# EAGLE design LED_Thermo (EAGLE 7.7.0)
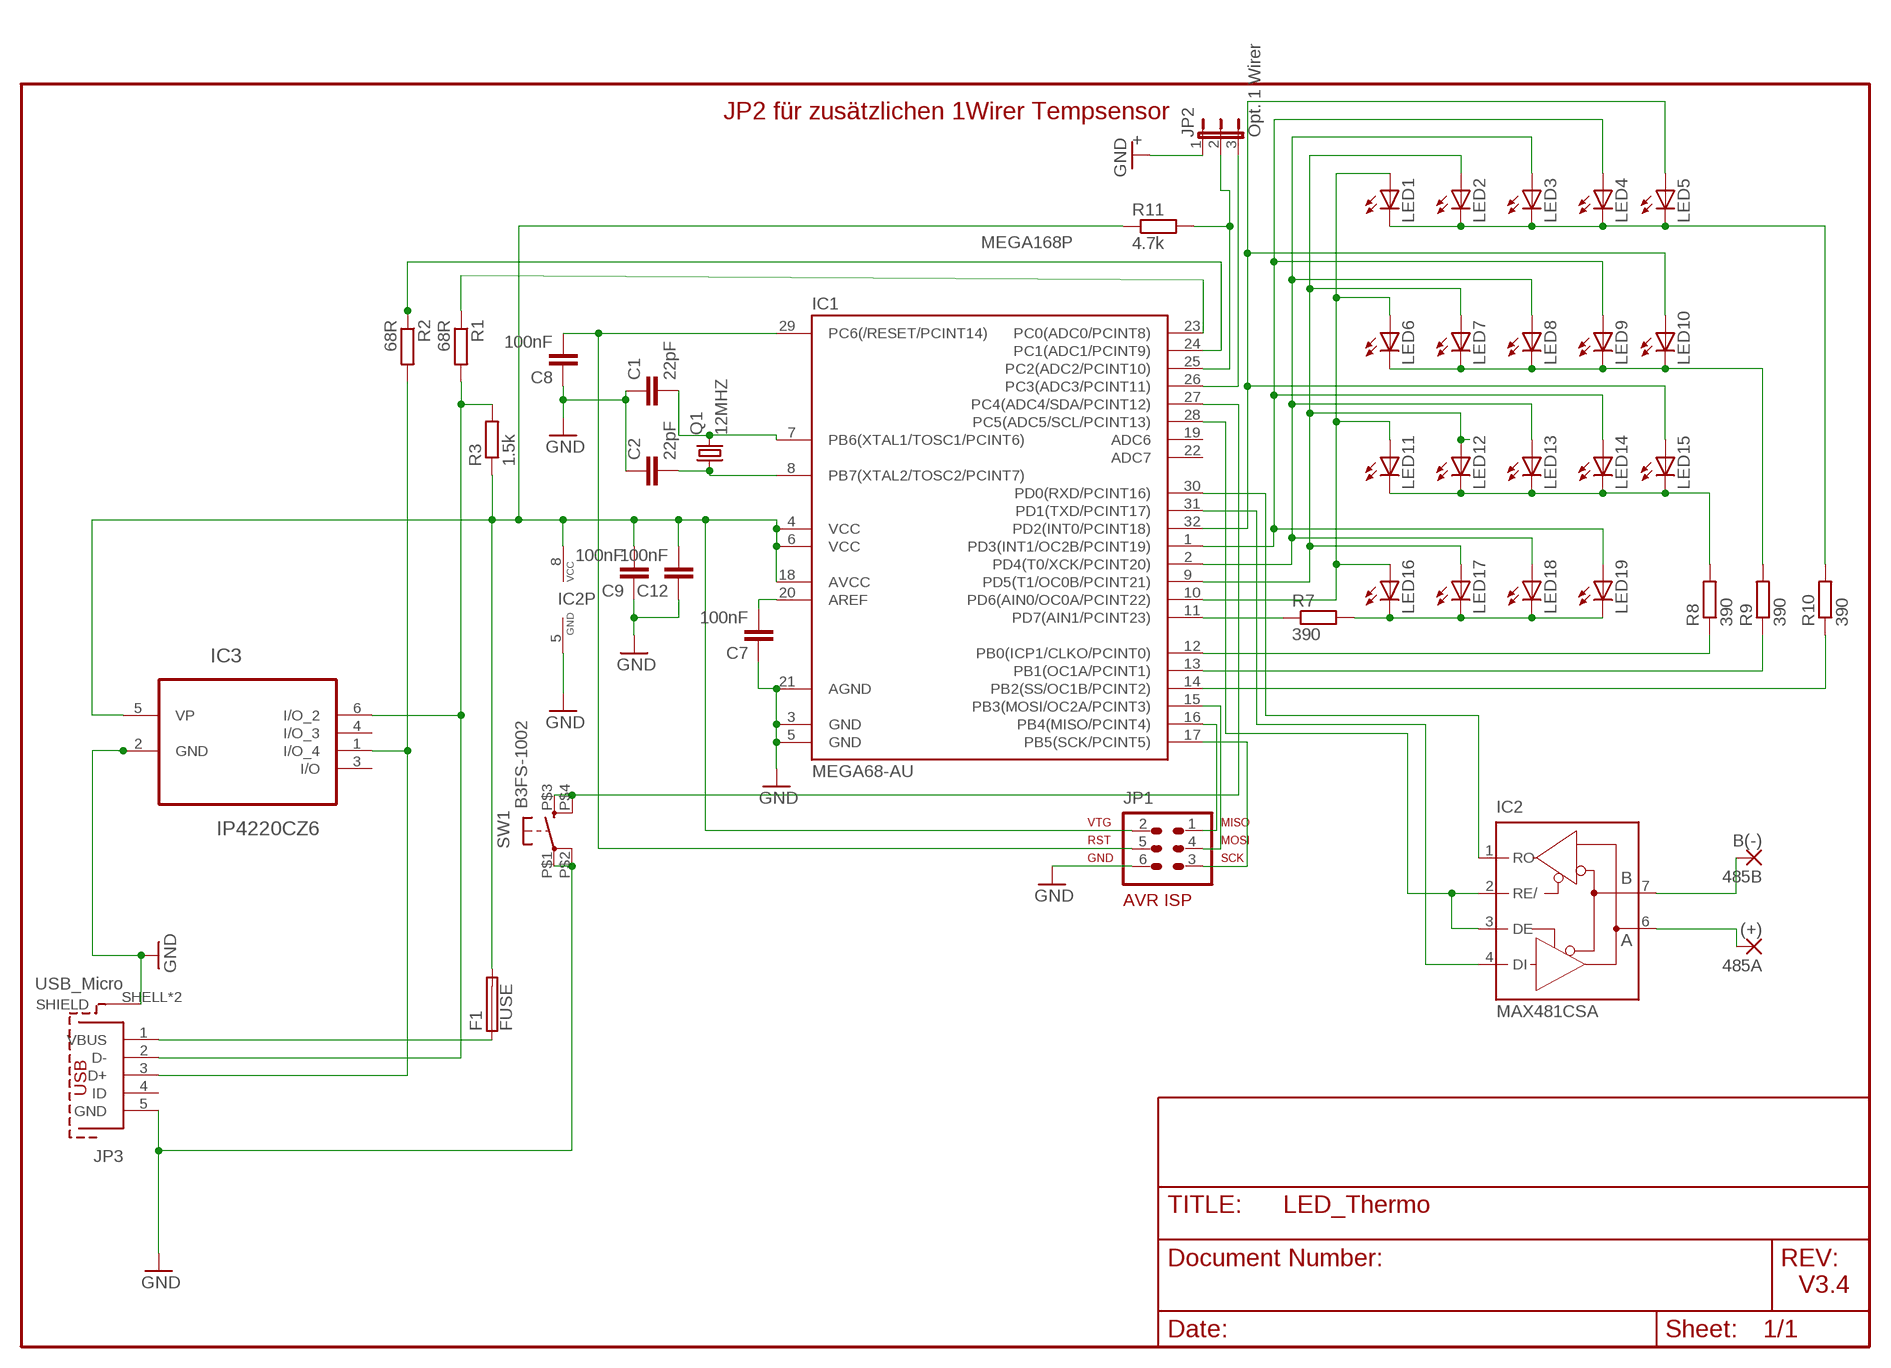
[diagram p0: schematic, sheet 1]

## Parts
485A  (+)  2,54/1,0  [2,54/1,0]
485B  B(-)  2,54/1,0  [2,54/1,0]
C1  22pF  C-EUC0805  [C0805]
C2  22pF  C-EUC0805  [C0805]
C7  100nF  C-EUC0805  [C0805]
C8  100nF  C-EUC0805  [C0805]
C9  100nF  C-EUC0805  [C0805]
C12  100nF  C-EUC0805  [C0805]
F1  FUSE  [FUSE_1206]
IC1  MEGA68-AU  MEGA48/88/168-AU  [TQFP32-08]
IC2  MAX481CSA  [SO08]
IC3  IP4220CZ6  [SOT95P275X110-6N]
JP1  AVR-ISP-6  [AVR-ISP-6]
JP2  Opt. 1 Wirer  JP2E  [JP2]
JP3  USB_Micro  614105150721  [614105150721]
LED1  LED3MM  [LED3MM]
LED2  LED3MM  [LED3MM]
LED3  LED3MM  [LED3MM]
LED4  LED3MM  [LED3MM]
LED5  LED3MM  [LED3MM]
LED6  LED3MM  [LED3MM]
LED7  LED3MM  [LED3MM]
LED8  LED3MM  [LED3MM]
LED9  LED3MM  [LED3MM]
LED10  LED3MM  [LED3MM]
LED11  LED3MM  [LED3MM]
LED12  LED3MM  [LED3MM]
LED13  LED3MM  [LED3MM]
LED14  LED3MM  [LED3MM]
LED15  LED3MM  [LED3MM]
LED16  LED3MM  [LED3MM]
LED17  LED3MM  [LED3MM]
LED18  LED3MM  [LED3MM]
LED19  LED3MM  [LED3MM]
Q1  12MHZ  CRYSTALHC18U-V  [HC18U-V]
R1  68R  R-EU_M0805  [M0805]
R2  68R  R-EU_M0805  [M0805]
R3  1.5k  R-EU_M0805  [M0805]
R7  390  R-EU_M0805  [M0805]
R8  390  R-EU_M0805  [M0805]
R9  390  R-EU_M0805  [M0805]
R10  390  R-EU_M0805  [M0805]
R11  4.7k  R-EU_M0805  [M0805]
SW1  B3FS-1002  B3FS-10XX  [B3FS-1002]

## Nets
GND: C1.1 C2.1 C7.1 C8.1 C9.1 C12.1 IC1.3(GND) IC1.5(GND) IC1.21(AGND) IC2.5(GND) IC3.2(GND) JP1.6 JP2.1 JP3.5(GND) JP3.SHELL1(SHIELD) JP3.SHELL(SHIELD) SW1.P$1(P) SW1.P$2(P1)
N$1: IC1.23(PC0(ADC0/PCINT8)) R1.1
N$2: IC1.10(PD6(AIN0/OC0A/PCINT22)) LED1.A LED6.A LED11.A LED16.A
N$3: IC1.24(PC1(ADC1/PCINT9)) R2.1
N$4: F1.1 JP3.1(VBUS)
N$5: IC1.9(PD5(T1/OC0B/PCINT21)) LED2.A LED7.A LED12.A LED17.A
N$6: IC1.27(PC4(ADC4/SDA/PCINT12)) SW1.P$3(S) SW1.P$4(S1)
N$7: IC3.1(I/O_4) JP3.3(D+) R2.2
N$8: IC3.6(I/O_2) JP3.2(D-) R1.2 R3.2
N$9: IC1.2(PD4(T0/XCK/PCINT20)) LED3.A LED8.A LED13.A LED18.A
N$10: LED16.K(C) LED17.K(C) LED18.K(C) LED19.K(C) R7.2
N$11: LED11.K(C) LED12.K(C) LED13.K(C) LED14.K(C) LED15.K(C) R8.2
N$12: IC1.1(PD3(INT1/OC2B/PCINT19)) LED4.A LED9.A LED14.A LED19.A
N$13: LED6.K(C) LED7.K(C) LED8.K(C) LED9.K(C) LED10.K(C) R9.2
N$14: LED1.K(C) LED2.K(C) LED3.K(C) LED4.K(C) LED5.K(C) R10.2
N$15: IC1.17(PB5(SCK/PCINT5)) JP1.3
N$16: IC1.16(PB4(MISO/PCINT4)) JP1.1
N$17: IC1.15(PB3(MOSI/OC2A/PCINT3)) JP1.4
N$18: IC1.12(PB0(ICP1/CLKO/PCINT0)) R8.1
N$19: IC1.13(PB1(OC1A/PCINT1)) R9.1
N$20: C7.2 IC1.20(AREF)
N$21: C8.2 IC1.29(PC6(/RESET/PCINT14)) JP1.5
N$22: IC1.14(PB2(SS/OC1B/PCINT2)) R10.1
N$23: IC1.32(PD2(INT0/PCINT18)) LED5.A LED10.A LED15.A
N$24: C1.2 IC1.7(PB6(XTAL1/TOSC1/PCINT6)) Q1.2
N$25: C2.2 IC1.8(PB7(XTAL2/TOSC2/PCINT7)) Q1.1
N$26: 485B.1(P) IC2.7(B)
N$27: IC1.31(PD1(TXD/PCINT17)) IC2.4(DI)
N$28: IC1.30(PD0(RXD/PCINT16)) IC2.1(RO)
N$29: IC1.28(PC5(ADC5/SCL/PCINT13)) IC2.2(RE/) IC2.3(DE)
N$30: 485A.1(P) IC2.6(A)
N$31: IC1.26(PC3(ADC3/PCINT11)) JP2.3
N$32: IC1.11(PD7(AIN1/PCINT23)) R7.1
N$33: IC1.25(PC2(ADC2/PCINT10)) JP2.2 R11.2
VCC: C9.2 C12.2 F1.2 IC1.4(VCC) IC1.6(VCC) IC1.18(AVCC) IC2.8(VCC) IC3.5(VP) JP1.2 R3.1 R11.1
Unconnected: IC1.19(ADC6) IC1.22(ADC7) IC3.3(I/O) IC3.4(I/O_3) JP3.4(ID)

## Notes on the sheet
- JP2 für zusätzlichen 1Wirer Tempsensor
- +
- MEGA168P
- V3.4

## Library data of the parts
485A 485B = wirepad:2,54/1,0: THROUGH-HOLE PAD
C1 C2 C7-C9 C12 = rcl:C-EU: CAPACITOR, European symbol
F1 = fuse:FUSE: Fuse
IC1 = avr-4_2:MEGA48/88/168
IC2 = maxim:MAX481CSA: RS485 TRANSEIVER
IC3 = IP4220CZ6:IP4220CZ6: Dual Schmitt-Trigger Inverter; AVAILABILITY: Unavailable; DESCRIPTION: Integrated circuit: ESD protection; SOT457; MF: Nexperia USA; MP: IP4220CZ6; PACKAGE: TSOP-6 Nexperia; PRICE: None
JP1 = atmel:AVR-ISP-6: AVR ISP-6 Serial Programming Header
JP2 = jumper:JP2E: JUMPER
JP3 = InputOutputIO (rev19b):614105150721: WR-COM_USB_Micro Type B_Vertical_THT; Micro Type B Vertical THT- Tape & Reel not for Pick & Place machine Code : Con_I-O_COM_USB_2.0_B_614105150721_614105150721 <http://katalog.we-online.de/media/images/eican/Con_I-O_COM_USB_2.0_B_614105150721_pf2.jpg> Details see: http://katalog.we-online.de/em/datasheet/614105150721.pdf Created 12/08/2014, Dan Xu 2014 (C) Wurth Elektronik
LED1-LED19 = led:LED: LED OSRAM: - CHIPLED LG R971, LG N971, LY N971, LG Q971, LY Q971, LO R971, LY R971 LH N974, LH R974 LS Q976, LO Q976, LY Q976 LO Q996 - Hyper CHIPLED LW Q18S LB Q993, LB Q99A, LB R99A - SideLED LS A670, LO A670, LY A670, LG A670, LP A670 LB A673, LV A673, LT A673, LW A673 LH A674 LY A675 LS A676, LA A676, LO A676, LY A676, LW A676 LS A679, LY A679, LG A679 - Hyper Micro SIDELED® LS Y876, LA Y876, LO Y876, LY Y876 LT Y87S - SmartLED LW L88C, LW L88S LB L89C, LB L89S, LG L890 LS L89K, LO L89K, LY L89K LS L896, LA L896, LO L896, LY L896 - TOPLED LS T670, LO T670, LY T670, LG T670, LP T670 LSG T670, LSP T670, LSY T670, LOP T670, LYG T670 LG T671, LOG T671, LSG T671 LB T673, LV T673, LT T673, LW T673 LH T674 LS T676, LA T676, LO T676, LY T676, LB T676, LH T676, LSB T676, LW T676 LB T67C, LV T67C, LT T67C, LS T67K, LO T67K, LY T67K, LW E67C LS E67B, LA E67B, LO E67B, LY E67B, LB E67C, LV E67C, LT E67C LW T67C LS T679, LY T679, LG T679 LS T770, LO T770, LY T770, LG T770, LP T770 LB T773, LV T773, LT T773, LW T773 LH T774 LS E675, LA E675, LY E675, LS T675 LS T776, LA T776, LO T776, LY T776, LB T776 LHGB T686 LT T68C, LB T68C - Hyper Mini TOPLED® LB M676 - Mini TOPLED Santana® LG M470 LS M47K, LO M47K, LY M47K Source: http://www.osram.convergy.de - LUMILED® LXK2-PW12-R00, LXK2-PW12-S00, LXK2-PW14-U00, LXK2-PW14-V00 LXK2-PM12-R00, LXK2-PM12-S00, LXK2-PM14-U00 LXK2-PE12-Q00, LXK2-PE12-R00, LXK2-PE12-S00, LXK2-PE14-T00, LXK2-PE14-U00 LXK2-PB12-K00, LXK2-PB12-L00, LXK2-PB12-M00, LXK2-PB14-N00, LXK2-PB14-P00, LXK2-PB14-Q00 LXK2-PR12-L00, LXK2-PR12-M00, LXK2-PR14-Q00, LXK2-PR14-R00 LXK2-PD12-Q00, LXK2-PD12-R00, LXK2-PD12-S00 LXK2-PH12-R00, LXK2-PH12-S00 LXK2-PL12-P00, LXK2-PL12-Q00, LXK2-PL12-R00 Source: www.luxeon.com
Q1 = crystal:CRYSTAL: CRYSTAL; OC_FARNELL: unknown; OC_NEWARK: unknown
R1-R3 R7-R11 = rcl:R-EU_: RESISTOR, European symbol
SW1 = switch-omron:B3FS-10XX: SWITCH SMD Osram B3FS1002

## Board
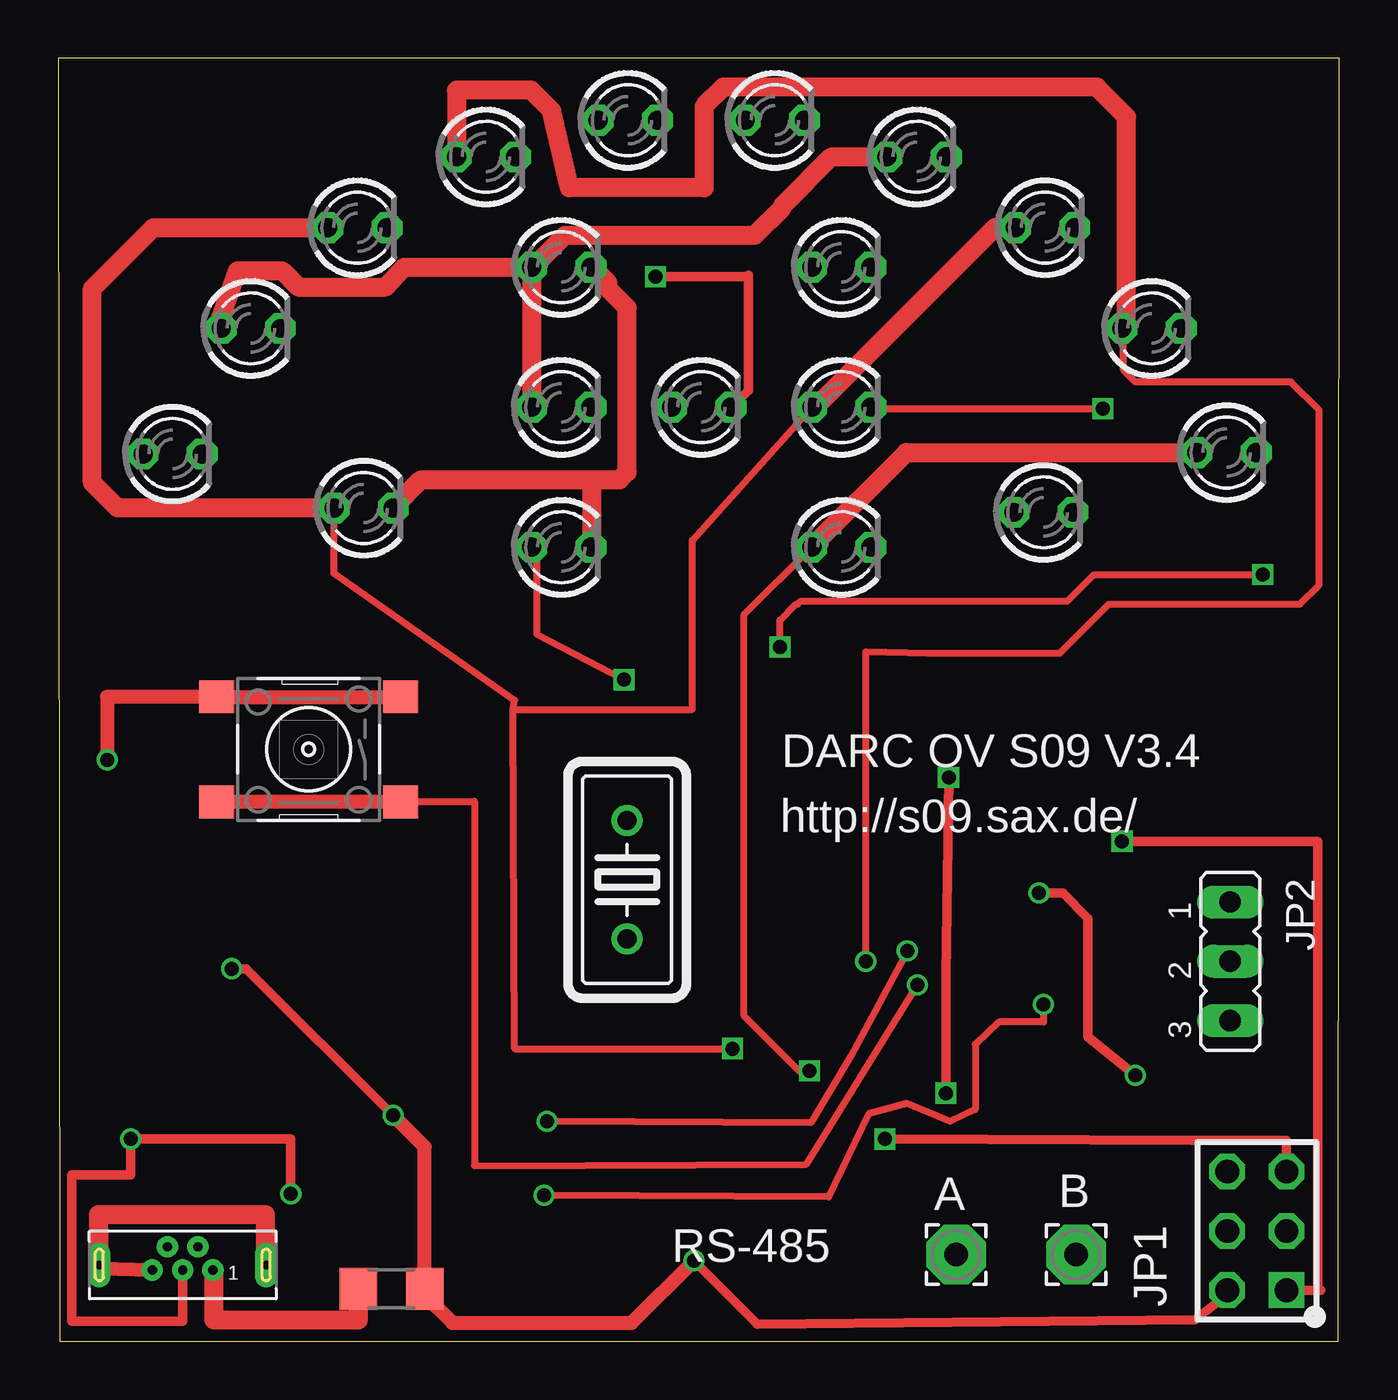
[diagram p1: board, top side]
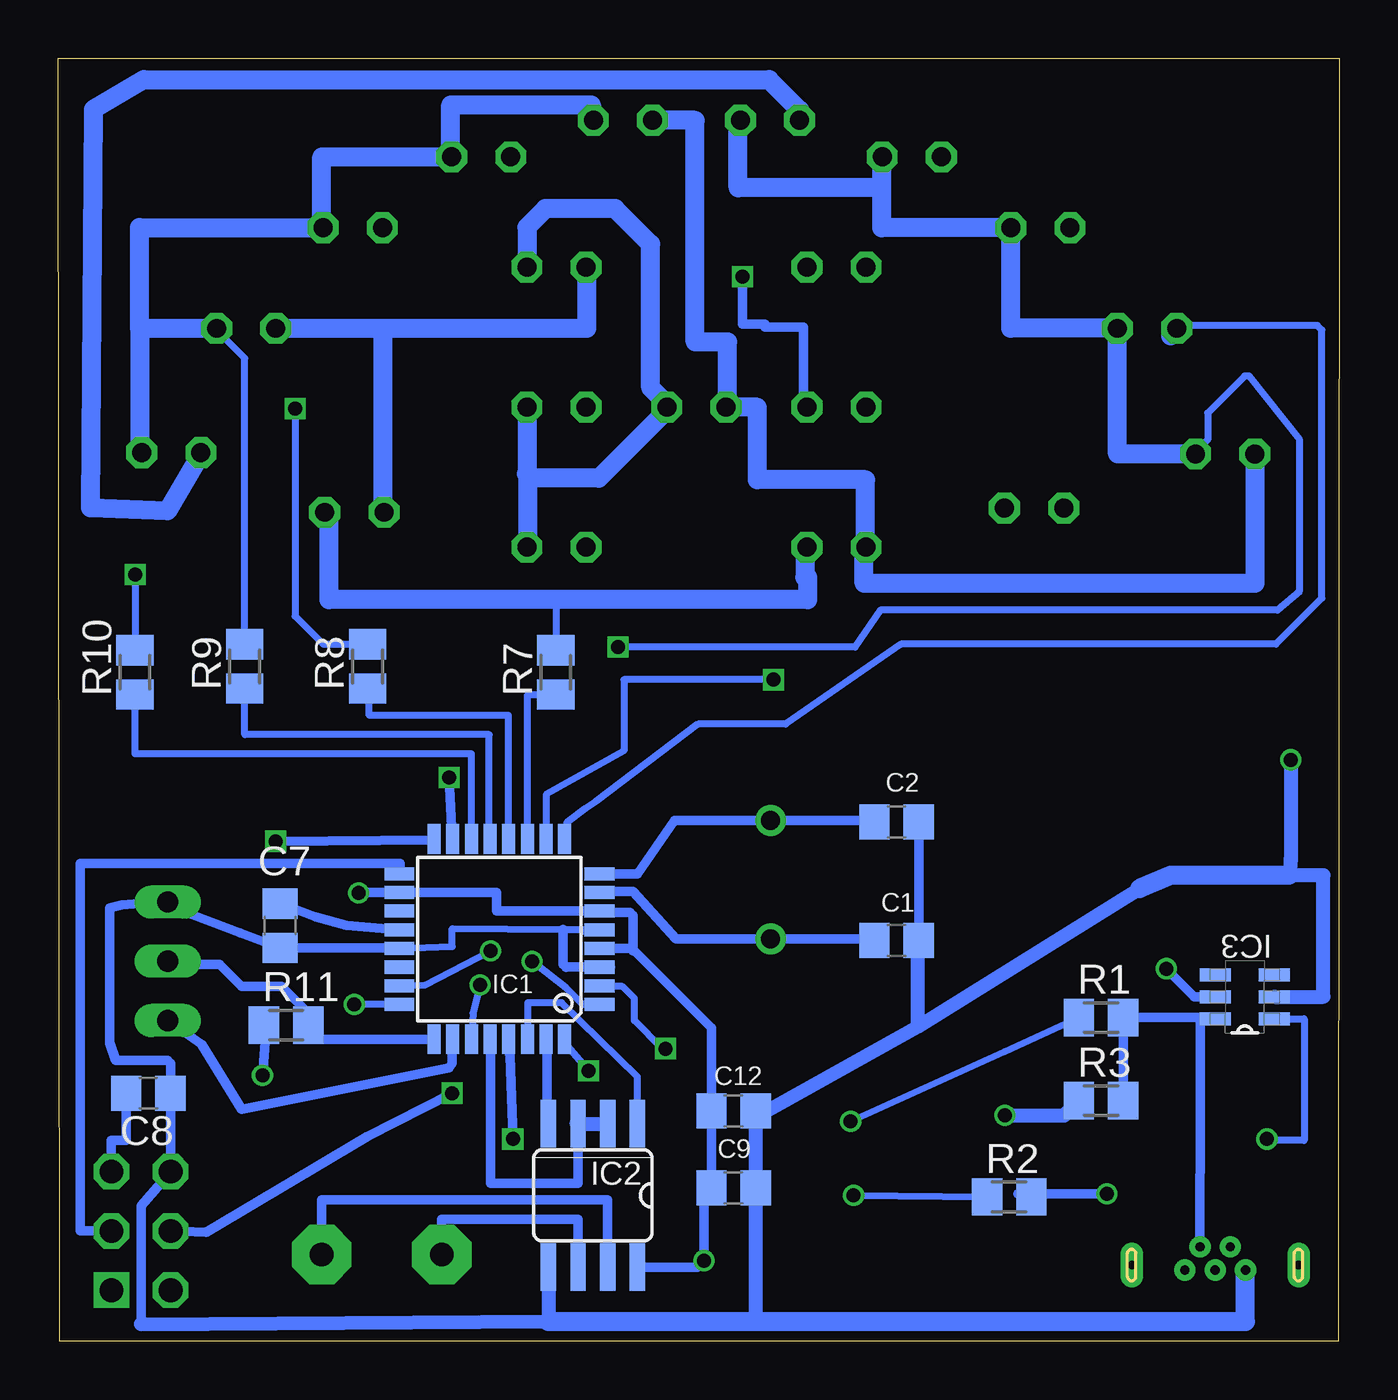
[diagram p2: board, bottom side, seen from below]

Size 54.91 x 54.98 mm. Coordinates in mm from the lower left corner, seen from the top.
Outline: 0.06,0 54.84,0 54.91,54.98 0,54.98 0.06,0
Copper layers (1*16): Top 0.035mm / dielectric 1.5mm / Bottom 0.035mm
Design rules "multi_pcb *": minimum track width 6mil, minimum drill 6mil, track to track 6mil, track to pad 6mil, pad to pad 6mil, via to via 6mil, smd to smd 6mil, copper to edge 6mil, drill to drill 6mil, minimum pad ring 10mil, minimum via ring 6mil, stop-mask expansion 0mil, vias tented up to drill 25mil, thermal gap 10mil

### Footprints (pad centres in the part's own frame; a part is rotated, then mirrored left to right if it is on the bottom)
2,54/1,0 = drill 1.016 pad 2.54 octagon: 1 0,0
C0805 = smd 1.3 x 1.5: 1 -0.95,0; 2 0.95,0
FUSE_1206 = smd 1.6 x 1.803: 1 -1.422,0; 2 1.422,0
TQFP32-08 = smd 1.27 x 0.559: 1 -4.293,2.8; 2 -4.293,2; 3 -4.293,1.2; 4 -4.293,0.4; 5 -4.293,-0.4; 6 -4.293,-1.2; 7 -4.293,-2; 8 -4.293,-2.8; 17 4.293,-2.8; 18 4.293,-2; 19 4.293,-1.2; 20 4.293,-0.4; 21 4.293,0.4; 22 4.293,1.2; 23 4.293,2; 24 4.293,2.8 | smd 0.559 x 1.27: 9 -2.8,-4.293; 10 -2,-4.293; 11 -1.2,-4.293; 12 -0.4,-4.293; 13 0.4,-4.293; 14 1.2,-4.293; 15 2,-4.293; 16 2.8,-4.293; 25 2.8,4.293; 26 2,4.293; 27 1.2,4.293; 28 0.4,4.293; 29 -0.4,4.293; 30 -1.2,4.293; 31 -2,4.293; 32 -2.8,4.293
SO08 = smd 0.66 x 2.032: 1 -1.905,-3.073; 2 -0.635,-3.073; 3 0.635,-3.073; 4 1.905,-3.073; 5 1.905,3.073; 6 0.635,3.073; 7 -0.635,3.073; 8 -1.905,3.073
SOT95P275X110-6N = smd 1.321 x 0.559: 1 -1.27,0.94; 2 -1.27,0; 3 -1.27,-0.94; 4 1.27,-0.94; 5 1.27,0; 6 1.27,0.94
AVR-ISP-6 = drill 1.016 square: 1 -2.54,-1.27 | drill 1.016 octagon: 2 -2.54,1.27; 3 0,-1.27; 4 0,1.27; 5 2.54,-1.27; 6 2.54,1.27
JP2 = drill 0.914 long: 1 -2.54,0; 2 0,0; 3 2.54,0
614105150721 = drill 0.4: 1 -1.3,0.22; 2 -0.65,-0.78; 3 0,0.22; 4 0.65,-0.78; 5 1.3,0.22 | drill 0.35 pad 0.97 long: SHELL -3.575,0; SHELL1 3.575,0
LED3MM = drill 0.813 octagon: A -1.27,0; K 1.27,0
HC18U-V = drill 0.813: 1 -2.54,0; 2 2.54,0
M0805 = smd 1.3 x 1.6: 1 -0.95,0; 2 0.95,0
B3FS-1002 = smd 1.5 x 1.4: P$1 3.95,-2.25; P$2 -3.95,-2.25; P$3 3.95,2.25; P$4 -3.95,2.25

### Placement (x,y rotation side)
485A  38.48,3.71 0 top
485B  43.62,3.71 0 top
C1  18.98,17.17 180 bottom
C2  18.98,22.25 180 bottom
C7  45.4,17.81 90 bottom
C8  51.05,10.63 180 bottom
C9  25.97,6.57 180 bottom
C12  25.97,9.87 180 bottom
F1  14.28,2.25 0 top
IC1  36,17.23 180 bottom
IC2  32,6.25 180 bottom
IC3  4.06,14.76 180 bottom
JP1  51.37,4.72 90 top
JP2  50.22,16.28 270 top
JP3  5.33,3.26 180 top
LED1  4.9,38.03 0 top
LED2  8.25,43.41 0 top
LED3  12.82,47.72 0 top
LED4  18.33,50.76 0 top
LED5  24.41,52.33 0 top
LED6  30.71,52.33 0 top
LED7  36.79,50.76 0 top
LED8  42.29,47.73 0 top
LED9  46.86,43.41 0 top
LED10  50.07,38.09 0 top
LED11  27.56,40.03 0 top
LED12  21.56,40.03 0 top
LED13  33.56,40.03 0 top
LED14  33.56,46.03 0 top
LED15  33.56,34.03 0 top
LED16  21.56,34.03 0 top
LED17  21.56,46.03 0 top
LED18  13.09,35.71 0 top
LED19  42.22,35.52 0 top
Q1  24.38,19.77 270 top
R1  10.22,13.87 0 bottom
R2  14.16,6.19 0 bottom
R3  10.22,10.31 0 bottom
R7  33.59,28.66 90 bottom
R8  41.65,28.92 90 bottom
R9  46.92,28.92 90 bottom
R10  51.62,28.66 90 bottom
R11  45.14,13.55 0 bottom
SW1  10.73,25.36 180 top

### Tracks (layer width: path | path; a pad name or v marks a point on that pad's centre or on a via)
GND  (via drill 0.6)
  Top 0.61: JP3.SHELL 8.88,3.33 | JP3.5 1.75,3.11 JP3.SHELL1 | v2.09,24.92 2.09,27.61 SW1.P$1 SW1.P$2
  Top 0.813: 8.88,3.33 8.88,5.42 1.71,5.42 JP3.SHELL1
  Bottom 0.305: IC1.5 32.43,17.57 31.94,17.62 33.33,17.62 33.27,17.66 38.03,17.68 38.03,16.92 IC1.21
  Bottom 0.406: 31.24,16.03 IC1.3 33.14,16.03 33.27,16.15 33.27,17.66 | 31.87,17.63 31.87,17.68 | 31.87,17.63 IC1.5 | 31.87,17.62 31.87,17.63 | 51.37,0.72 51.37,5.8 JP1.6 C8.1 50.1,11.9 50.22,12.03 52.45,12.03 52.7,12.79 52.7,18.57 52.19,18.69 51.43,18.76 JP2.1 49.78,18.5 47.11,17.49 C7.1 43.24,16.85 40.3,16.85 IC1.21 | C2.1 C1.1
  Bottom 0.61: 50.16,7.26 JP1.6 | IC2.5 33.9,0.85 51.37,0.72 | 25.02,0.85 C9.1 C12.1 25.01,9.93 24.89,9.68 18.08,13.47 | 18.08,13.47 8.57,19.39 | v2.09,24.92 2.09,20.66 2.16,19.96 0.69,19.96 0.69,14.76 IC3.2 | C1.1 18.08,17.17 18.08,13.47
  Bottom 0.813: 33.9,0.85 25.02,0.85 4.03,0.85 JP3.5 | 2.16,19.96 7.24,19.96 8.57,19.39
N$1  (via drill 0.6)
  Top 0.305: v36.38,16.73 33.97,12.22 32.25,9.36 v20.95,9.42
  Bottom 0.305: IC1.23 39.19,15.27 v36.38,16.73 | v20.95,9.42 14.34,12.41 R1.1
N$2  (via drill 0.6)
  Top 0.305: v24.25,28.35 20.51,30.32 20.51,33.93 20.31,34.12 20.29,34.1 LED16.A
  Bottom 0.305: IC1.10 34,23.42 30.67,25.3 30.67,28.35 v24.25,28.35
  Bottom 0.813: LED1.A 3.61,38.03 3.61,32.47 20.38,32.47 20.38,34.03 LED16.A 20.31,34.03 | LED6.A 27.62,52.33 27.62,42.82 26.22,42.82 26.22,40.03 LED11.A 24.95,40.03 24.95,36.92 20.31,36.92 20.31,34.03 | 20.31,34.03 20.31,33.93
N$3  (via drill 0.6)
  Top 0.305: v42.22,14.44 42.22,13.68 40.32,13.68 39.3,12.73 39.3,9.93 38.22,9.42 36.38,10.19 34.73,9.74 33.01,6.19 v20.82,6.25
  Bottom 0.305: IC1.24 40.31,14.44 v42.22,14.44 | v20.82,6.25 R2.1
N$4
  Top 0.813: JP3.1 6.66,3.04 6.66,0.91 12.86,0.91 F1.1
N$5
  Top 0.813: LED17.A 14.82,46.03 14.03,45.17 10.28,45.17 9.58,45.87 7.68,45.87 6.8,43.41 | 6.8,43.41 6.73,43.33 | LED2.A 6.8,43.41 | LED12.A 20.31,40.03 20.29,40.06 LED17.A | LED17.A 20.34,46.03 21.71,47.4 29.84,47.4 31.05,48.6 31.05,48.67 33.14,50.76 35.55,50.76 35.56,50.76 | 35.56,50.76 35.62,50.7 | 35.56,50.76 LED7.A
  Bottom 0.305: IC1.9 33.11,22.22 32.32,22.82 31.87,23.14 27.49,26.44 23.74,26.44 18.79,29.87 2.73,29.87 0.76,31.84 0.76,43.33 0.95,43.52 6.85,43.52 LED2.A | LED2.A | LED2.A
  Bottom 0.813: LED2.A 6.98,43.33 7.23,43.08
N$6  (via drill 0.6)
  Top 0.305: SW1.P$4 14.7,23.14 17.84,23.14 17.84,7.52 32.06,7.58 v36.83,15.27
  Top 0.61: SW1.P$4 SW1.P$3
  Bottom 0.305: v36.83,15.27 37.14,14.06 IC1.27
N$7  (via drill 0.6)
  Top 0.406: JP3.3 5.33,0.85 0.57,0.85 0.57,7.14 3.11,7.14 v3.11,8.66 9.96,8.66 v9.96,6.31
  Bottom 0.305: IC3.1 1.52,13.82 1.52,8.6 3.11,8.6 v3.11,8.66
  Bottom 0.406: R2.2 13.78,6.31 v9.96,6.31
N$8
  Bottom 0.406: JP3.2 5.96,10.31 5.96,13.74 | R3.2 R1.2 5.96,13.87 5.96,13.74 | 5.96,13.74 5.33,13.74 IC3.6
N$9  (via drill 0.6)
  Top 0.305: LED18.A 11.82,32.91 19.55,27.46 19.49,27.08 | 19.49,27.08 19.55,12.53 v28.89,12.53 | 32.32,39.9 32.19,39.9 27.17,34.32 27.17,27.08 19.49,27.08
  Top 0.813: LED18.A 2.54,35.71 1.46,36.79 1.46,45.11 4.06,47.71 11.49,47.71 11.55,47.65 | 11.55,47.65 | 11.55,47.65 LED3.A | LED13.A 32.29,39.93 32.32,39.9 40.14,47.73 LED8.A
  Bottom 0.305: v28.89,12.53 29.01,12.53 30.22,13.74 30.22,14.69 30.73,15.2 31.49,15.2 31.55,15.27 31.59,15.23 IC1.2
N$10
  Top 0.813: LED18.K 14.35,35.71 15.55,36.92 22.6,36.92 | 22.6,36.92 22.66,36.92 22.86,36.73 22.86,34.12 22.76,34.03 | 22.76,34.03 22.73,34 | 22.76,34.03 LED16.K | LED17.K 22.89,46.03 23.55,45.36 23.55,45.11 24.38,44.29 24.38,37.24 24.06,36.92 22.6,36.92
  Bottom 0.305: 33.59,31.78 R7.2
  Bottom 0.813: LED19.K 43.3,35.52 43.3,31.78 33.59,31.78 22.79,31.78 22.79,32.73 22.92,32.73 22.92,34.03 LED16.K
N$11  (via drill 0.6)
  Top 0.305: LED13.K 34.83,40 34.79,39.97 v44.76,39.97
  Top 0.406: v25.59,45.62 29.52,45.62 29.59,45.68 29.59,40.73 28.83,39.97 | 28.83,39.97 28.82,39.97 | 28.83,39.97 LED11.K
  Bottom 0.305: R8.2 43.55,29.87 44.76,31.08 v44.76,39.97
  Bottom 0.406: LED12.K 22.98,40.03 22.98,43.46 24.63,43.46 24.63,43.59 25.59,43.59 v25.59,45.62
  Bottom 0.813: 34.79,34.03 34.79,33.87 | 34.79,34.03 LED15.K | LED13.K 34.79,40.03 34.79,37.17 | 34.79,37.17 34.79,34.03 | 34.79,37.17 34.86,37.17 34.67,36.98 31.74,36.98 28.83,39.9 LED11.K 28.76,40.09 29.52,40.86 29.52,47.02 31.05,48.54 34.03,48.54 34.83,47.74 LED14.K
N$12  (via drill 0.6)
  Top 0.305: 45.59,43.46 | 45.59,43.46 LED9.A | 45.59,43.46 45.65,43.4 45.65,41.62 46.16,41.11 52.83,41.11 54.03,39.9 54.03,32.41 53.21,31.58 45.02,31.58 42.92,29.49 37.27,29.49 34.6,29.55 v34.6,16.28
  Top 0.813: LED4.A 17.06,53.6 17.08,53.62 20.25,53.62 21.14,52.73 21.9,49.43 27.68,49.43 27.68,52.92 28.51,53.75 44.51,53.75 45.78,52.48 45.78,43.52 45.59,43.33 | 45.59,43.33 | LED9.A 45.59,43.33
  Bottom 0.305: IC1.1 32.43,14.43 33.14,15.14 v34.6,16.28
  Bottom 0.813: 41.02,35.52 41.02,35.33 | 41.02,35.52 LED19.A | LED9.A 41.02,43.41 | 41.02,43.41 41.02,35.52 | LED14.A 32.25,46.03 32.25,43.41 41.02,43.41
N$13
  Bottom 0.305: LED9.K 48.13,43.33 46.92,42.13 R9.2
  Bottom 0.813: LED10.K 51.43,38.09 51.43,43.4 | 48.06,43.41 48.06,43.46 | LED9.K 48.06,43.41 | 51.43,43.4 48.06,43.4 48.06,43.41 | 51.43,43.4 51.43,47.73 LED8.K 43.62,47.73 | 43.62,47.73 43.62,47.71 | 43.62,47.73 43.62,50.76 LED7.K 38.09,50.76 38.09,52.98 32.06,52.98 32.06,52.33 LED6.K
N$14  (via drill 0.6)
  Top 0.305: v51.62,32.86 44.38,32.86 43.24,31.71 31.81,31.71 31.68,31.58 31.62,31.58 30.92,30.89 v30.92,29.74
  Bottom 0.305: v51.62,32.86 R10.2 | v30.92,29.74 20.76,29.74 19.68,31.33 2.66,31.33 1.71,32.16 1.71,38.63 3.87,41.36 4.06,41.36 5.65,39.78 5.65,38.63 6.22,38.06 6.18,38.03 LED1.K
  Bottom 0.813: LED1.K 9.52,38.03 LED2.K 14.09,43.41 LED3.K 19.62,47.72 19.62,49.43 | LED4.K 19.62,50.76 19.62,49.43 | LED5.K 25.78,52.33 25.78,49.43 19.62,49.43
N$15
  Bottom 0.406: JP1.3 53.97,4.72 53.97,20.47 40.25,20.47 40.25,20.03 IC1.17
N$16  (via drill 0.6)
  Top 0.406: JP1.1 54.1,2.18 53.97,2.25 53.97,21.42 v45.59,21.42
  Bottom 0.406: IC1.16 38.8,21.5 38.79,21.49 38.86,21.49 v45.59,21.42
N$17  (via drill 0.6)
  Top 0.406: v38.03,10.63 38.03,15.65 v38.16,24.16
  Bottom 0.406: JP1.4 48.57,4.66 41.65,8.79 v38.03,10.63 | IC1.15 37.97,21.55 38.03,21.62 v38.16,24.16
N$18
  Bottom 0.305: R8.1 41.59,27.97 41.59,26.82 35.62,26.82 IC1.12
N$19
  Bottom 0.305: IC1.13 36.44,21.52 36.44,26 46.92,26 R9.1
N$20
  Bottom 0.406: C7.2 43.87,18.19 42.55,17.82 IC1.20
N$21  (via drill 0.6)
  Top 0.406: v35.43,8.66 48.57,8.6 52.64,8.6 JP1.5
  Bottom 0.406: IC1.29 35.6,12.55 35.62,12.53 35.55,12.22 v35.43,8.66 | C8.2 52,8.6 52.64,8.6 JP1.5
N$22
  Bottom 0.305: R10.1 51.62,25.17 37.21,25.17 IC1.14
N$23  (via drill 0.6)
  Top 0.305: v32.19,11.58 31.74,11.58 29.4,13.93 29.4,31.14 32.25,34
  Top 0.813: 32.25,34 LED15.A | LED15.A | LED10.A 36.34,38.09 LED15.A
  Bottom 0.305: IC1.32 33.2,12.79 v32.19,11.58
  Bottom 0.813: LED5.A 23.14,52.76 24.44,54.06 51.24,54.06 53.4,52.79 53.53,35.71 50.22,35.59 48.76,38.06 48.79,38.09 LED10.A
N$24
  Bottom 0.406: IC1.7 31.74,19.2 | IC1.7 | IC1.7 31.68,19.27 30.28,19.27 28.44,17.23 Q1.2 19.93,17.23 C1.2
N$25
  Bottom 0.406: IC1.8 30.09,20.03 28.51,22.31 Q1.1 24.32,22.31 19.93,22.31 C2.2
N$26
  Bottom 0.406: 485B.1 43.62,6.06 31.36,6.06 IC2.7
N$27
  Bottom 0.406: IC1.31 33.97,12.94 33.97,9.32 IC2.4
N$28
  Bottom 0.305: IC2.1 30.09,11.33 33.33,14.5 34.79,14.5 34.79,12.98
  Bottom 0.406: 34.79,12.98 34.8,12.97 IC1.30
N$29
  Bottom 0.406: IC2.3 32.63,6.76 36.38,6.76 36.38,12.94 IC1.28
  Bottom 0.61: IC2.2 IC2.3 32.7,9.32 32.7,9.36
N$30
  Bottom 0.406: 32.57,3.18 IC2.6 32.63,5.23 38.48,5.23 485A.1
N$31
  Bottom 0.406: JP2.3 48.76,12.73 47.05,9.93 38.16,11.71 38.03,11.9 38.03,12.91 IC1.26
N$32
  Bottom 0.305: 34.79,21.52 34.79,21.49 | IC1.11 34.79,21.52 | R7.1 34.79,27.71 34.79,21.52
N$33
  Bottom 0.406: IC1.25 43.58,12.94 R11.2 44.19,14.06 45.33,15.2 47.05,15.2 48,16.15 49.4,16.15 JP2.2
VCC  (via drill 0.6)
  Top 0.406: JP1.2 50.1,1.99 48.7,0.91 29.97,0.72 v27.24,3.45 | v7.42,15.96 8.06,15.96 v14.35,9.68 | v42.03,19.2 43.05,19.2 44.13,18.12 44.13,13.04 v46.16,11.39
  Top 0.61: v27.24,3.45 24.57,0.79 16.89,0.79 15.7,1.97 F1.2 15.7,8.32 v14.35,9.68
  Bottom 0.406: IC1.4 30.39,16.83 30.28,16.73 30.28,16.79 | 30.28,16.79 30.28,18.25 30.41,18.38 31.62,18.38 31.67,18.43 IC1.6 31.81,18.43 31.81,18.44 36.13,18.44 36.13,19.23 IC1.18 42.01,19.23 v42.03,19.2 | 30.28,16.79 26.92,13.42 C12.2 26.92,9.93 26.92,10.5 26.92,6.63 C9.2 27.24,6.25 v27.24,3.45 27.52,3.18 IC2.8 30.03,3.18 | IC3.5 6.22,14.76 v7.42,15.96 | v46.16,11.39 46.03,13.11 R11.1
  Bottom 0.61: IC2.8 30.09,3.52 | v14.35,9.68 11.8,9.68 R3.1

### Text on the board
tNames: DARC OV S09 V3.4 | http://s09.sax.de/ | A | B | RS-485